# Altium schematic sheet 继电器输出.SchDoc: 分区电源管理电路板-继电器
size A4; Organization: 智能实训室产品部; Address1: 广东省深圳市; Address2: 宝安区石岩凯普达工业园; DocumentNumber: 190416; Revision: V1.0; SheetNumber: 3; SheetTotal: 6; Date: 2019-4-24; ApprovedBy: 杨青; CheckedBy: 杨青; DrawnBy: 杨青; Engineer: 杨青; ProjectName_GTA: 实训室智能化管理系统; PCB Number: GS-P1B-GXO02
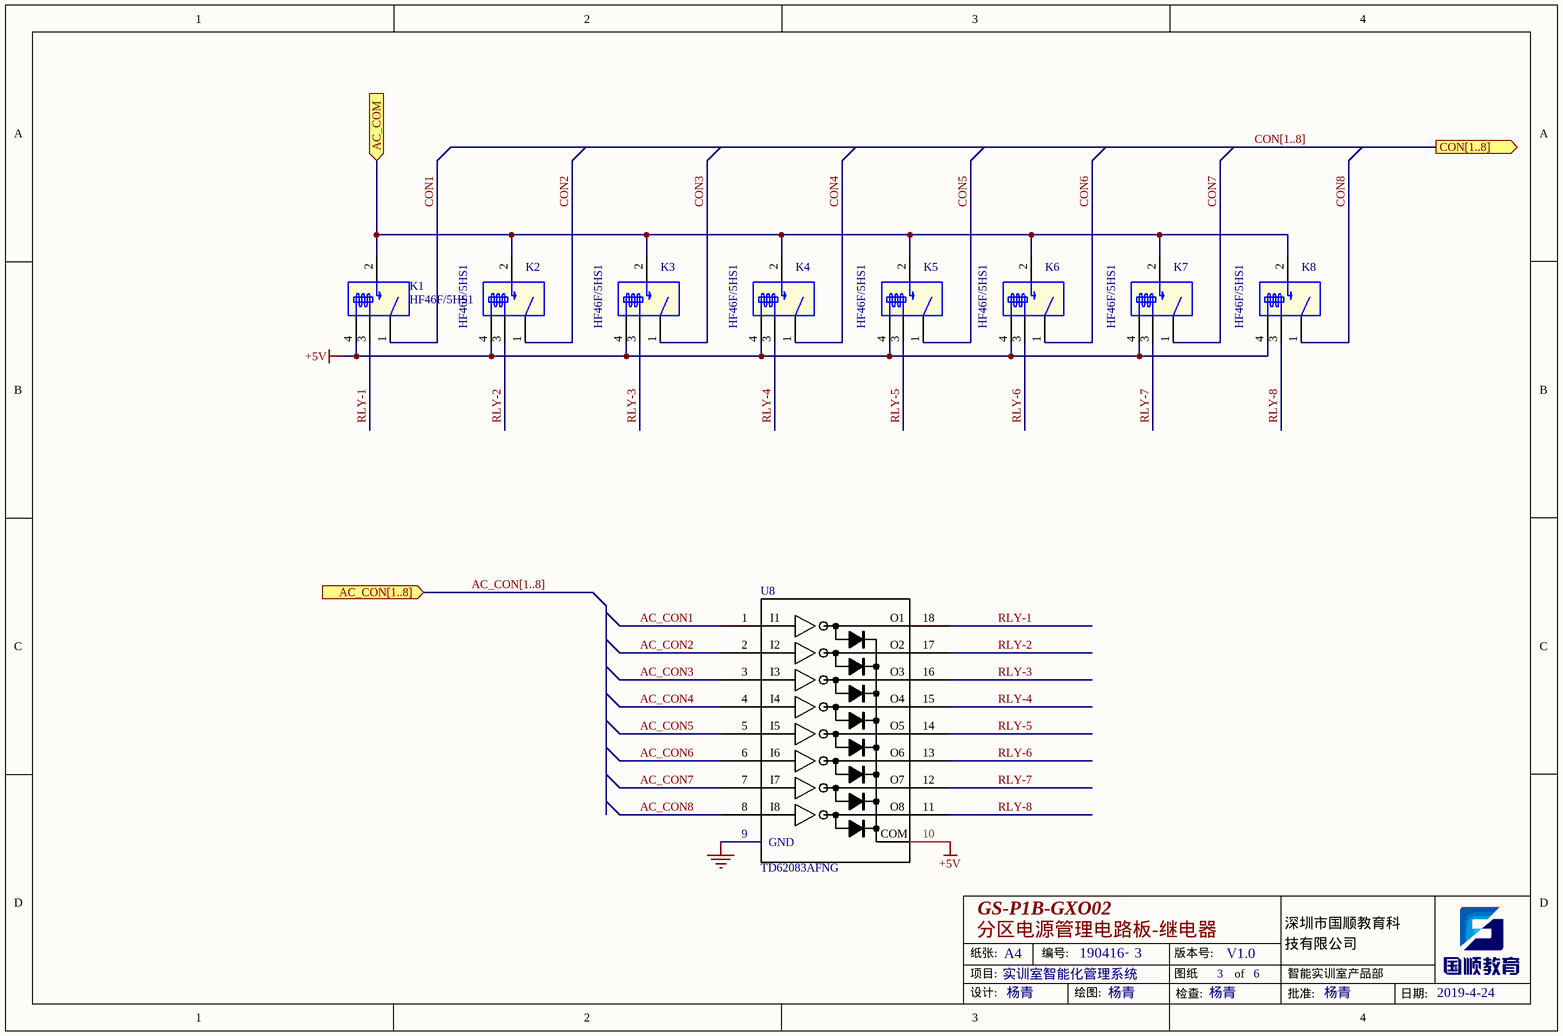
[diagram p0: 继电器输出.SchDoc]

## Parts
K1  HF46F/5HS1  [RELAY_HF46F]
K2  HF46F/5HS1  [RELAY_HF46F]
K3  HF46F/5HS1  [RELAY_HF46F]
K4  HF46F/5HS1  [RELAY_HF46F]
K5  HF46F/5HS1  [RELAY_HF46F]
K6  HF46F/5HS1  [RELAY_HF46F]
K7  HF46F/5HS1  [RELAY_HF46F]
K8  HF46F/5HS1  [RELAY_HF46F]
U8  TD62083AFNG  [TSSOP18-0.65/4.4]

## Ports
AC_COM (in), AC_CON[1..8] (in), CON[1..8] (out)

## Nets
+5V: K1.4(COIL2) K2.4(COIL2) K3.4(COIL2) K4.4(COIL2) K5.4(COIL2) K6.4(COIL2) K7.4(COIL2) K8.4(COIL2) U8.10(COM)
GND: U8.9(GND)
AC_COM: K1.2(NO) K2.2(NO) K3.2(NO) K4.2(NO) K5.2(NO) K6.2(NO) K7.2(NO) K8.2(NO) ; port AC_COM
AC_CON1: U8.1(I1)
AC_CON2: U8.2(I2)
AC_CON3: U8.3(I3)
AC_CON4: U8.4(I4)
AC_CON5: U8.5(I5)
AC_CON6: U8.6(I6)
AC_CON7: U8.7(I7)
AC_CON8: U8.8(I8)
CON1: K1.1(COM)
CON2: K2.1(COM)
CON3: K3.1(COM)
CON4: K4.1(COM)
CON5: K5.1(COM)
CON6: K6.1(COM)
CON7: K7.1(COM)
CON8: K8.1(COM)
RLY-1: K1.3(COIL1) U8.18(O1)
RLY-2: K2.3(COIL1) U8.17(O2)
RLY-3: K3.3(COIL1) U8.16(O3)
RLY-4: K4.3(COIL1) U8.15(O4)
RLY-5: K5.3(COIL1) U8.14(O5)
RLY-6: K6.3(COIL1) U8.13(O6)
RLY-7: K7.3(COIL1) U8.12(O7)
RLY-8: K8.3(COIL1) U8.11(O8)

## Buses and harness runs
bus AC_CON[1..8] = port AC_CON[1..8]
bus CON[1..8] = port CON[1..8]

## Notes on the sheet
- 纸张:
- 项目:
- A4
- 编号:
- -
- 版本号:
- 图纸
- of
- 深圳市国顺教育科
- 技有限公司
- 设计:
- 绘图:
- 检查:
- 批准:
- 日期:

## Library data of the parts
K1-K8 = HF46F/5HS1-5VDC: HF46F/5HS1,5V,容量 3A 250VAC/5A 30VDC,线圈功率200mW; 编码: 1011001020; 物料名称: 继电器; 规格/型号: HF46F/5HS1,5V; 参数: 3A 250VAC/5A 30VDC,线圈功率200mW
U8 = TD62083AFNG_TSSOP18_(LOGIC): 驱动IC; 物料名称: 贴片芯片; 规格/型号: TD62083AFNG,TSSOP18; 单价: 1.5